# EAGLE design cheapboard1.1 (EAGLE 6.2)
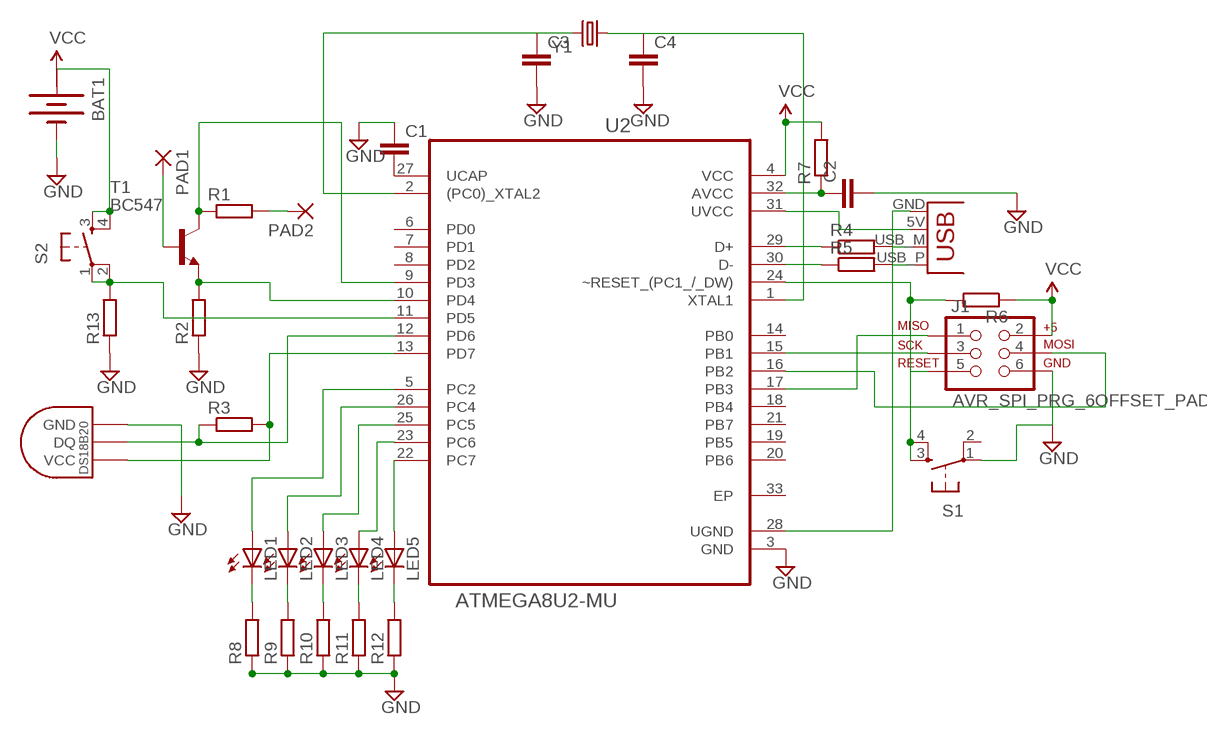
[diagram p0: schematic, sheet 1]

## Parts
BAT1  BATTERY  [BATTERY]
C1  CAP0805  [0805]
C2  CAP0805  [0805]
C3  CAP0805  [0805]
C4  CAP0805  [0805]
J1  AVR_SPI_PRG_6OFFSET_PADS  [2X3_OFFSET]
JP1  USBPCB  [USB-A-PCB]
LED1  LEDCHIPLED_0805  [CHIPLED_0805]
LED2  LEDCHIPLED_0805  [CHIPLED_0805]
LED3  LEDCHIPLED_0805  [CHIPLED_0805]
LED4  LEDCHIPLED_0805  [CHIPLED_0805]
LED5  LEDCHIPLED_0805  [CHIPLED_0805]
PAD1  SMD5  [SMD2,54-5,08]
PAD2  SMD5  [SMD2,54-5,08]
R1  R-EU_M0805  [M0805]
R2  R-EU_M0805  [M0805]
R3  R-EU_M0805  [M0805]
R4  R-EU_M0805  [M0805]
R5  R-EU_M0805  [M0805]
R6  R-EU_M0805  [M0805]
R7  R-EU_M0805  [M0805]
R8  R-EU_M0805  [M0805]
R9  R-EU_M0805  [M0805]
R10  R-EU_M0805  [M0805]
R11  R-EU_M0805  [M0805]
R12  R-EU_M0805  [M0805]
R13  R-EU_M0805  [M0805]
S1  TAC_SWITCHSMD  [TACTILE_SWITCH_SMD]
S2  TAC_SWITCHSMD  [TACTILE_SWITCH_SMD]
T1  BC547  [TO92]
U2  ATMEGA8U2-MU  [QFN50P500X500X100-33N]
U$1  DS1820SOIC  [DS18B20_SOIC]
Y1  CRYSTAL5X3  [CRYSTAL-SMD-5X3]

## Nets
GND: BAT1.- C1.1 C2.2 C3.2 C4.2 J1.6 R2.1 R8.1 R9.1 R10.1 R11.1 R12.1 R13.1 S1.1 U2.3(GND) U$1.GND
N$1: R1.1 T1.3(C) U2.9(PD3)
N$2: J1.4 U2.16(PB2)
N$3: R2.2 T1.1(E) U2.10(PD4)
N$4: J1.5 R6.2 S1.3 S1.4 U2.24(~RESET_(PC1_/_DW))
N$5: J1.3 U2.15(PB1)
N$6: R3.1 U2.12(PD6) U$1.DQ
N$7: J1.1 U2.17(PB3)
N$8: JP1.5V(VBUS) U2.31(UVCC)
N$9: C2.1 R7.1 U2.32(AVCC)
N$10: R4.1 U2.29(D+)
N$11: R5.1 U2.30(D-)
N$12: JP1.USB_M(D-) R4.2
N$13: JP1.USB_P(D+) R5.2
N$14: R3.2 U2.13(PD7) U$1.VCC
N$15: JP1.GND U2.28(UGND)
N$16: C1.2 U2.27(UCAP)
N$17: C4.1 U2.1(XTAL1) Y1.1
N$18: C3.1 U2.2((PC0)_XTAL2) Y1.3
N$19: LED1.A U2.5(PC2)
N$20: LED2.A U2.26(PC4)
N$21: LED3.A U2.25(PC5)
N$22: LED4.A U2.23(PC6)
N$23: LED5.A U2.22(PC7)
N$24: LED1.C R8.2
N$25: LED2.C R9.2
N$26: LED3.C R10.2
N$27: LED4.C R11.2
N$28: LED5.C R12.2
N$30: R13.2 S2.1 S2.2 U2.11(PD5)
PAD1: PAD1.1(P) T1.2(B)
PAD2: PAD2.1(P) R1.2
VCC: BAT1.+ J1.2 R6.1 R7.2 S2.3 S2.4 U2.4(VCC)
Unconnected: S1.2 U2.6(PD0) U2.7(PD1) U2.8(PD2) U2.14(PB0) U2.18(PB4) U2.19(PB5) U2.20(PB6) U2.21(PB7) U2.33(EP)

## Power pins joined to a net without a drawn wire
+: BAT1.+@1(+)

## Library data of the parts
BAT1 = special:BATTERY: BATTERY
C1-C4 = SparkFun-Passives:CAP: Capacitor Standard 0603 ceramic capacitor, and 0.1" leaded capacitor.
J1 = SparkFun-Connectors:AVR_SPI_PRG_6: AVR ISP 6 Pin This is the reduced ISP connector for AVR programming. Common on Arduino. This footprint will take up less PCB space and can be used with a 10-pin to 6-pin adapter such as SKU: BOB-08508
JP1 = SparkFun-Connectors:USB: USB Connectors USB-B-PTH is fully proven SKU : PRT-00139/CONN-08278 USB-miniB is fully proven SKU : PRT-00587 USB-A-PCB is untested. USB-A-H is throughly reviewed, but untested. Spark Fun Electronics SKU : PRT-00437 USB-B-SMT is throughly reviewed, but untested. Needs silkscreen touching up. USB-A-S has not been used/tested USB-MB-H has not been used/tested USB-MICROB has been used. CONN-09505
LED1-LED5 = led:LED: LED OSRAM: - CHIPLED LG R971, LG N971, LY N971, LG Q971, LY Q971, LO R971, LY R971 LH N974, LH R974 LS Q976, LO Q976, LY Q976 LO Q996 - Hyper CHIPLED LW Q18S LB Q993, LB Q99A, LB R99A - SideLED LS A670, LO A670, LY A670, LG A670, LP A670 LB A673, LV A673, LT A673, LW A673 LH A674 LY A675 LS A676, LA A676, LO A676, LY A676, LW A676 LS A679, LY A679, LG A679 - Hyper Micro SIDELED® LS Y876, LA Y876, LO Y876, LY Y876 LT Y87S - SmartLED LW L88C, LW L88S LB L89C, LB L89S, LG L890 LS L89K, LO L89K, LY L89K LS L896, LA L896, LO L896, LY L896 - TOPLED LS T670, LO T670, LY T670, LG T670, LP T670 LSG T670, LSP T670, LSY T670, LOP T670, LYG T670 LG T671, LOG T671, LSG T671 LB T673, LV T673, LT T673, LW T673 LH T674 LS T676, LA T676, LO T676, LY T676, LB T676, LH T676, LSB T676, LW T676 LB T67C, LV T67C, LT T67C, LS T67K, LO T67K, LY T67K, LW E67C LS E67B, LA E67B, LO E67B, LY E67B, LB E67C, LV E67C, LT E67C LW T67C LS T679, LY T679, LG T679 LS T770, LO T770, LY T770, LG T770, LP T770 LB T773, LV T773, LT T773, LW T773 LH T774 LS E675, LA E675, LY E675, LS T675 LS T776, LA T776, LO T776, LY T776, LB T776 LHGB T686 LT T68C, LB T68C - Hyper Mini TOPLED® LB M676 - Mini TOPLED Santana® LG M470 LS M47K, LO M47K, LY M47K Source: http://www.osram.convergy.de LUXEON: - LUMILED® LXK2-PW12-R00, LXK2-PW12-S00, LXK2-PW14-U00, LXK2-PW14-V00 LXK2-PM12-R00, LXK2-PM12-S00, LXK2-PM14-U00 LXK2-PE12-Q00, LXK2-PE12-R00, LXK2-PE12-S00, LXK2-PE14-T00, LXK2-PE14-U00 LXK2-PB12-K00, LXK2-PB12-L00, LXK2-PB12-M00, LXK2-PB14-N00, LXK2-PB14-P00, LXK2-PB14-Q00 LXK2-PR12-L00, LXK2-PR12-M00, LXK2-PR14-Q00, LXK2-PR14-R00 LXK2-PD12-Q00, LXK2-PD12-R00, LXK2-PD12-S00 LXK2-PH12-R00, LXK2-PH12-S00 LXK2-PL12-P00, LXK2-PL12-Q00, LXK2-PL12-R00 Source: www.luxeon.com KINGBRIGHT: KA-3528ASYC Source: www.kingbright.com
PAD1 PAD2 = wirepad:SMD5: SMD PAD
R1-R13 = rcl:R-EU_: RESISTOR, European symbol
S1 S2 = SparkFun-Electromechanical:TAC_SWITCH: Momentary Switch Button commonly used for reset or general input. Spark Fun Electronics SKU : COM-00097 SMT- SWCH-08247; PROD_ID: SWCH-08247
T1 = transistor:BC547: NPN TRANSISTOR
U2 = Atmel_By_element14_Batch_1:ATMEGA8U2-MU: Microcontroller with 8/16/32K Bytes of ISP Flash and USB Controller; MPN: ATMEGA8U2-MU; OC_FARNELL: 1748536; OC_NEWARK: 26R5642; PACKAGE: QFN-32; SUPPLIER: Atmel
U$1 = Ava:DS1820: DS18B20 Programmable Resolution 1-Wire Digital Thermometer Description The DS18B20 digital thermometer provides 9-bit to 12-bit Celsius temperature measurements and has an alarm function with nonvolatile user-programmable upper and lower trigger points. The DS18B20 communicates over a 1-Wire® bus that by definition requires only one data line (and ground) for communication with a central microprocessor. It has an operating temperature range of -55°C to +125°C and is accurate to ±0.5°C over the range of -10°C to +85°C. In addition, the DS18B20 can derive power directly from the data line ("parasite power"), eliminating the need for an external power supply. Each DS18B20 has a unique 64-bit serial code, which allows multiple DS18B20s to function on the same 1-Wire bus. Thus, it is simple to use one microprocessor to control many DS18B20s distributed over a large area. Applications that can benefit from this feature include HVAC environmental controls, temperature monitoring systems inside buildings, equipment, or machinery, and process monitoring and control systems.
Y1 = SparkFun-FreqCtrl:CRYSTAL: Various standard crystals. Proven footprints. Spark Fun Electronics SKU : COM-00534

## Board
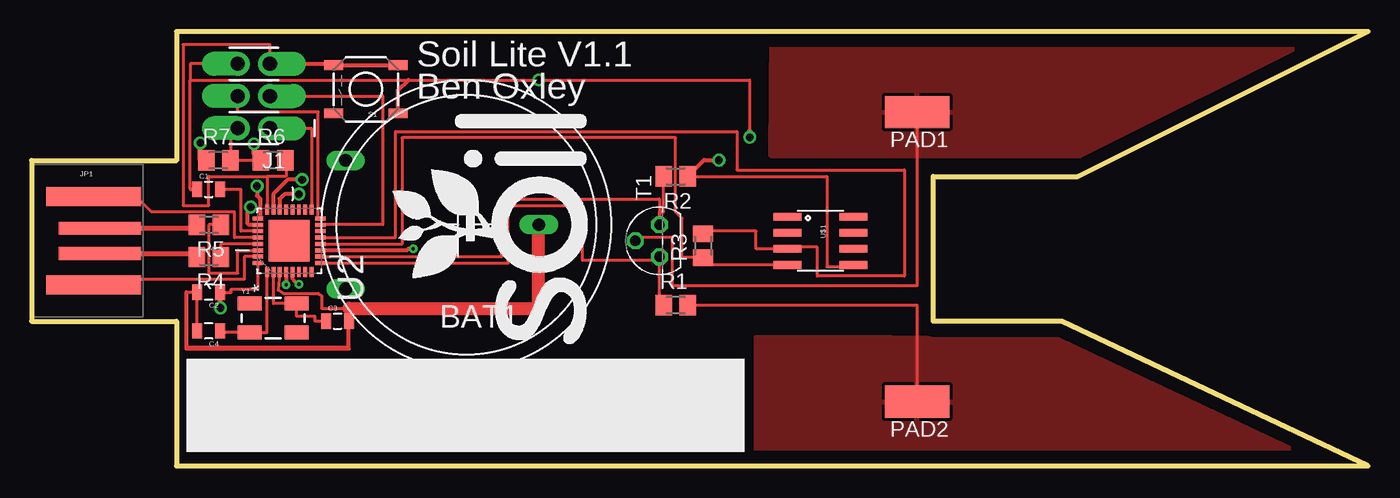
[diagram p1: board, top side]
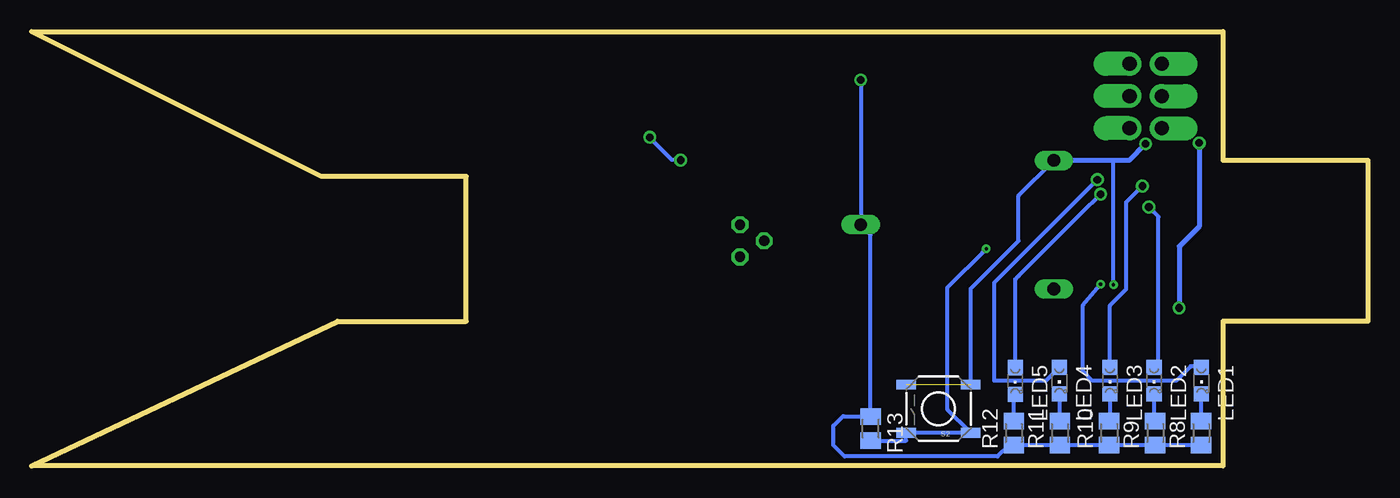
[diagram p2: board, bottom side, seen from below]

Size 105.41 x 34.29 mm. Coordinates in mm from the lower left corner, seen from the top.
Outline: 11.43,0 105.41,0 81.28,11.43 71.12,11.43 71.12,22.86 82.55,22.86 105.41,34.29 11.43,34.29 11.43,24.13 0,24.13 0,11.43 11.43,11.43 11.43,0
Copper layers (1*16): Top 0.035mm / dielectric 1.5mm / Bottom 0.035mm
Design rules: minimum track width 10mil, minimum drill 24mil, track to track 8mil, track to pad 8mil, pad to pad 8mil, via to via 8mil, smd to smd 8mil, copper to edge 40mil, drill to drill 8mil, minimum pad ring 10mil, minimum via ring 8mil, stop-mask expansion 4mil, vias tented up to drill 0mil, thermal gap 10mil

### Footprints (pad centres in the part's own frame; a part is rotated, then mirrored left to right if it is on the bottom)
BATTERY = drill 1.016 long: + 9.525,-5.08; +@1 9.525,5.08; - -5.715,0
0805 = smd 0.8 x 1.2: 1 -0.9,0; 2 0.9,0
2X3_OFFSET = drill 1.118 pad 1.88 offset: 1 -2.54,-1.27; 2 -2.54,1.27; 3 0,-1.27; 4 0,1.27; 5 2.54,-1.27; 6 2.54,1.27
USB-A-PCB = smd 7.5 x 1.5: 5V -0.2,-3.5; GND -0.2,3.5 | smd 6.5 x 1: USB_M 0.3,-1; USB_P 0.3,1
CHIPLED_0805 = smd 1.2 x 1.2: A 0,-1.05; C 0,1.05
SMD2,54-5,08 = smd 2.54 x 5.08: 1 0,0
M0805 = smd 1.3 x 1.6: 1 -0.95,0; 2 0.95,0
TACTILE_SWITCH_SMD = smd 1.524 x 0.762: 1 -2.54,1.905; 2 2.54,1.905; 3 -2.54,-1.905; 4 2.54,-1.905
TO92 = drill 0.813 octagon: 1 1.27,0; 2 0,1.905; 3 -1.27,0
QFN50P500X500X100-33N = smd 0.813 x 0.305: 1 -2.464,1.753; 2 -2.464,1.245; 3 -2.464,0.762; 4 -2.464,0.254; 5 -2.464,-0.254; 6 -2.464,-0.762; 7 -2.464,-1.245; 8 -2.464,-1.753; 17 2.464,-1.753; 18 2.464,-1.245; 19 2.464,-0.762; 20 2.464,-0.254; 21 2.464,0.254; 22 2.464,0.762; 23 2.464,1.245; 24 2.464,1.753 | smd 0.305 x 0.813: 9 -1.753,-2.464; 10 -1.245,-2.464; 11 -0.762,-2.464; 12 -0.254,-2.464; 13 0.254,-2.464; 14 0.762,-2.464; 15 1.245,-2.464; 16 1.753,-2.464; 25 1.753,2.464; 26 1.245,2.464; 27 0.762,2.464; 28 0.254,2.464; 29 -0.254,2.464; 30 -0.762,2.464; 31 -1.245,2.464; 32 -1.753,2.464 | smd 3.251 x 3.251: 33 0,0
DS18B20_SOIC = smd 0.61 x 2.21: DQ 1.905,-2.616; GND 1.905,2.616; NC -1.905,-2.616; NC2 -0.635,-2.616; NC3 -1.905,2.616; NC4 -0.635,2.616; NC5 0.635,2.616; VCC 0.635,-2.616
CRYSTAL-SMD-5X3 = smd 1.9 x 1.1: 1 -1.85,-1.15; 2 1.85,-1.15; 3 1.85,1.15; 4 -1.85,1.15

### Placement (x,y rotation side)
BAT1  34.29,19.05 180 top
C1  13.97,21.84 0 top
C2  13.97,13.72 180 top
C3  24.13,11.43 0 top
C4  13.97,10.67 180 top
J1  17.53,29.21 90 top
JP1  5.08,17.78 0 top
LED1  13.13,6.74 180 bottom
LED2  16.87,6.74 180 bottom
LED3  20.35,6.74 180 bottom
LED4  24.33,6.74 180 bottom
LED5  27.81,6.72 180 bottom
PAD1  69.85,27.94 90 top
PAD2  69.85,5.08 90 top
R1  50.8,12.7 0 top
R2  50.8,22.86 180 top
R3  52.96,17.4 90 top
R4  13.97,16.51 180 top
R5  13.97,19.05 180 top
R6  19.05,24.13 0 top
R7  14.73,24.13 0 top
R8  13.14,2.6 90 bottom
R9  16.78,2.6 90 bottom
R10  20.41,2.6 90 bottom
R11  24.3,2.6 90 bottom
R12  27.93,2.6 90 bottom
R13  39.23,2.96 270 bottom
S1  26.37,29.74 180 top
S2  33.87,4.52 180 bottom
T1  49.53,17.78 90 top
U2  20.32,17.78 90 top
U$1  62.23,17.78 270 top
Y1  19.05,11.68 0 top

### Tracks (layer width: path | path; a pad name or v marks a point on that pad's centre or on a via)
GND  (via drill 0.6, 0.6 pad 0.25)
  Top 0.254: C4.2 C2.2 12.19,13.72 12.19,9.4 25.03,9.4 C3.2 25.03,12.45 22.86,12.45 22.86,13.46 22.64,13.6 22.61,13.56 22.61,13.63 19.82,13.63 19.43,13.89 U2.3 | J1.6 12.52,31.75 12.52,30.48 | C1.1 12.51,21.86 12.52,30.48 | R2.1 62.74,22.86 62.74,15.75 64.85,15.75 U$1.GND | 12.52,30.48 29.72,30.48 v40.01,30.48 56.64,30.48 56.64,26.5
  Top 0.305: R2.1 53.05,24.16 v54.22,24.16 | v56.64,25.96 56.64,26.5 | 29.72,30.48 28.9,29.67 S1.1 | C1.1 12.57,21.84 | 12.19,13.72 12.19,9.27 25.02,9.27 25.02,12.57 40.01,12.57 40.01,12.7
  Top 1.016: 25.03,12.45 40.01,12.45 40.01,12.7 BAT1.-
  Bottom 0.305: v54.22,24.16 54.9,24.16 56.64,25.89 v56.64,25.96 | R8.1 R9.1 R10.1 R11.1 | R11.1 R12.1 | R11.1 28.32,1.65 29.21,0.76 41.27,0.76 42.16,1.65 42.16,3.17 41.4,3.94 39.26,3.94 R13.1 39.23,18.27 BAT1.- v40.01,30.48
N$1
  Top 0.254: U2.9 37.59,16.03 37.59,20.57 43.43,20.57 43.43,16.26 49.53,16.26 T1.3 49.53,12.7 R1.1
N$2
  Top 0.254: U2.16 22.61,19.53 22.61,27.94 16.26,27.94 J1.4
N$3
  Top 0.254: R2.2 49.85,20.07 49.53,20.07 T1.1 49.53,21.08 37.08,21.08 37.08,16.54 U2.10
N$4
  Top 0.254: J1.5 18.8,33.27 11.94,33.27 11.94,20.57 13.97,20.57 13.97,22.86 18.57,22.86 | 18.57,22.86 U2.24 | R6.2 20.07,24.13 20.07,22.86 18.57,22.86
  Top 0.305: J1.5 23.72,31.75 S1.4 S1.3
N$5
  Top 0.254: J1.3 27.69,29.21 27.69,19.05 22.78,19.05 U2.15
N$6
  Top 0.254: U$1.DQ 53.09,15.88 R3.1 51.31,16.45 51.31,19.56 50.8,20.07 50.8,25.91 29.21,25.91 29.21,17.53 U2.12
N$7
  Top 0.254: J1.1 22.07,26.67 U2.17
N$8
  Top 0.254: U2.31 16.76,16.54 16.76,14.73 4.88,14.73 JP1.5V
N$9  (via drill 0.6)
  Top 0.254: C2.1 15.75,13.72 15.75,13.97 17.86,13.97 U2.32 | R7.1 13.72,24.13 13.72,24.38
  Top 0.406: R7.1 13.3,24.13 v13.3,25.5 | v14.88,12.48 14.87,12.5 C2.1
  Bottom 0.406: v13.3,25.5 13.3,18.92 14.88,17.34 v14.88,12.48
N$10
  Top 0.254: U2.29 14.92,17.53 R4.1
N$11
  Top 0.254: R5.1 13.97,19.05 13.97,15.24 16.26,15.24 16.26,17.02 U2.30
N$12
  Top 0.406: JP1.USB_M 13.02,16.78 R4.2
N$13
  Top 0.406: JP1.USB_P 13.02,18.78 R5.2
N$14
  Top 0.254: R3.2 53.09,18.54 57.15,18.54 57.15,17.14 U$1.VCC 59.61,17.27 61.98,17.27 61.98,14.99 68.83,14.99 68.83,23.37 55.63,23.37 55.63,26.42 28.7,26.42 28.7,18.03 U2.13
N$15
  Top 0.254: U2.28 16,18.03 16,20.07 9.45,20.07 8.18,21.34 JP1.GND
N$16
  Top 0.254: U2.27 16.51,18.54 16.51,21.84 C1.2
N$17
  Top 0.254: U2.1 18.57,10.53 Y1.1 14.87,10.53 C4.1
N$18
  Top 0.254: U2.2 19.07,12.83 Y1.3 20.9,11.81 22.35,11.81 22.35,11.43 C3.1
N$19  (via drill 0.25)
  Top 0.305: v21.08,14.35 20.95,14.35 20.57,14.81 U2.5
  Bottom 0.305: LED1.A 13.21,7.87 13.97,7.87 15.11,6.73 21.72,6.73 22.48,7.49 22.48,12.7 v21.08,14.35
N$20  (via drill 0.6)
  Top 0.305: v17.27,20.45 17.02,20.19 17.02,19.18 17.14,19.05 17.83,19.05 U2.26
  Bottom 0.305: LED2.A 16.56,7.79 16.51,7.75 16.51,19.68 v17.27,20.45
N$21  (via drill 0.6)
  Top 0.305: v17.78,22.1 17.78,21.34 18.03,21.08 18.03,19.71 U2.25
  Bottom 0.305: LED3.A 20.34,12.68 19.05,13.97 19.05,20.83 v17.78,22.1
N$22  (via drill 0.6)
  Top 0.305: v21.34,22.61 20.19,22.61 19.05,21.46 19.05,20.27 U2.23
  Bottom 0.305: LED4.A 25.4,6.73 29.46,6.73 29.46,14.48 v21.34,22.61
N$23  (via drill 0.6)
  Top 0.305: v21.08,21.46 19.94,21.46 19.56,21.08 U2.22
  Bottom 0.305: LED5.A 27.81,14.73 27.56,14.99 22.1,20.47 21.59,20.95 v21.08,21.46
N$24
  Bottom 0.305: R8.2 13.14,5.68 LED1.C
N$25
  Bottom 0.305: LED2.C 16.87,3.64 R9.2
N$26
  Bottom 0.305: LED3.C 20.34,3.62 R10.2
N$27
  Bottom 0.305: R11.2 24.29,5.66 LED4.C
N$28
  Bottom 0.305: R12.2 27.93,5.55 LED5.C
N$30  (via drill 0.25 pad 0.25)
  Top 0.305: v30.1,17.14 29.72,17.14 29.59,17.02 U2.11
  Bottom 0.305: R13.2 36.44,2.01 S2.2 S2.1 31.45,2.74 33.15,4.45 33.15,14.1 v30.1,17.14 30.44,16.8
PAD1
  Top 0.254: PAD1.1 69.85,14.22 50.55,14.22 50.55,18.03 47.62,18.03 T1.2
  pour Top: 108.2,36.7 58.42,39.24 58.29,24.51 90.04,24.51
PAD2
  Top 0.254: R1.2 69.85,12.7 PAD2.1
  pour Top (isolate 0.254): 89.28,10.03 57.15,10.16 57.15,-0.51 108.97,-0.51
VCC  (via drill 0.25 pad 0.25, 0.6)  (1 unrouted)
  Top 0.254: J1.2 15.68,26.67 R7.2 R6.1
  Top 0.305: U2.4 v20.07,14.31
  Top 0.406: R6.1 17.54,24.69 v17.54,25.44
  Bottom 0.305: v20.07,14.31 20.07,24.13 | S2.3 31.33,14.01 27.56,17.78 27.56,21.34 BAT1.+
  Bottom 0.406: v17.54,25.44 18.85,24.13 20.07,24.13 BAT1.+

### Text on the board
_tsilk: Soil Lite V1.1 | Ben Oxley